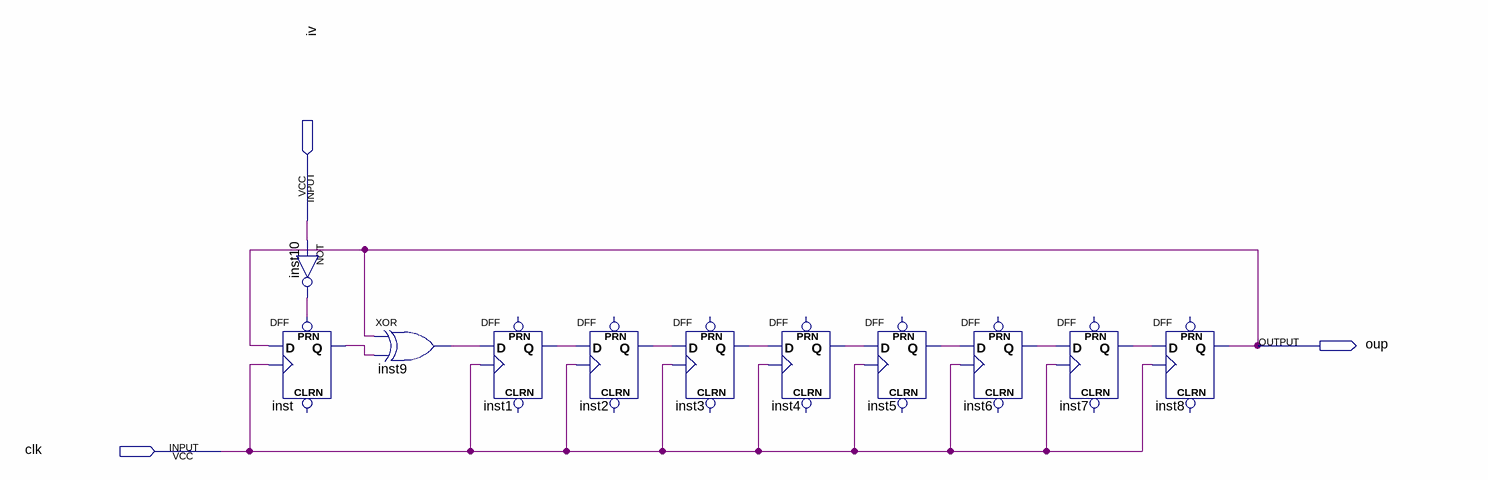
[diagram p0: schematic sheet]
// Quartus schematic dfflfsr.bdf as structural Verilog: 11 symbols, 3 pins
module dfflfsr (
  input  iv,
  input  clk,
  output oup
);

  wire inst1_q, inst2_q, inst3_q, inst4_q, inst5_q, inst6_q, inst7_q, inst9_out, inst10_out, inst_q;

  not inst10 (inst10_out, iv);
  DFF inst (.CLK(clk), .D(oup), .PRN(inst10_out), .Q(inst_q));  // open: CLRN
  xor inst9 (inst9_out, oup, inst_q);
  DFF inst1 (.CLK(clk), .D(inst9_out), .Q(inst1_q));  // open: CLRN, PRN
  DFF inst2 (.CLK(clk), .D(inst1_q), .Q(inst2_q));  // open: CLRN, PRN
  DFF inst3 (.CLK(clk), .D(inst2_q), .Q(inst3_q));  // open: CLRN, PRN
  DFF inst4 (.CLK(clk), .D(inst3_q), .Q(inst4_q));  // open: CLRN, PRN
  DFF inst5 (.CLK(clk), .D(inst4_q), .Q(inst5_q));  // open: CLRN, PRN
  DFF inst6 (.CLK(clk), .D(inst5_q), .Q(inst6_q));  // open: CLRN, PRN
  DFF inst7 (.CLK(clk), .D(inst6_q), .Q(inst7_q));  // open: CLRN, PRN
  DFF inst8 (.CLK(clk), .D(inst7_q), .Q(oup));  // open: CLRN, PRN
endmodule
